# Altium schematic sheet EP1K100QC208-2.SchDoc
size A2
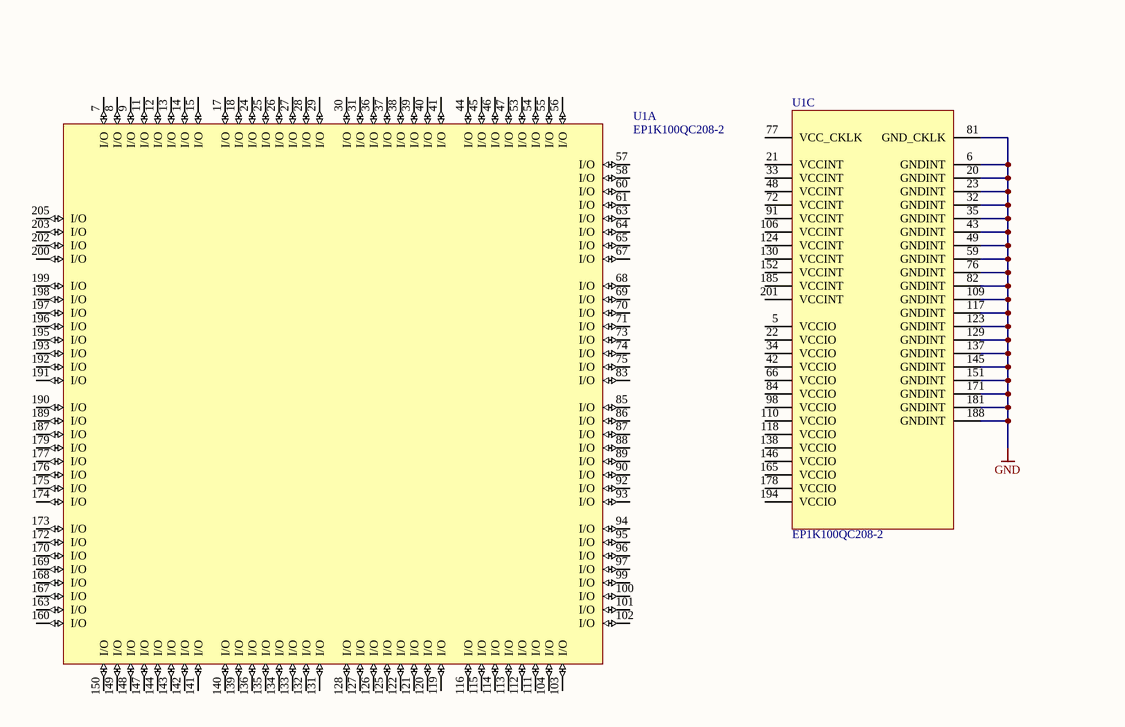
[diagram p0: EP1K100QC208-2.SchDoc, left]
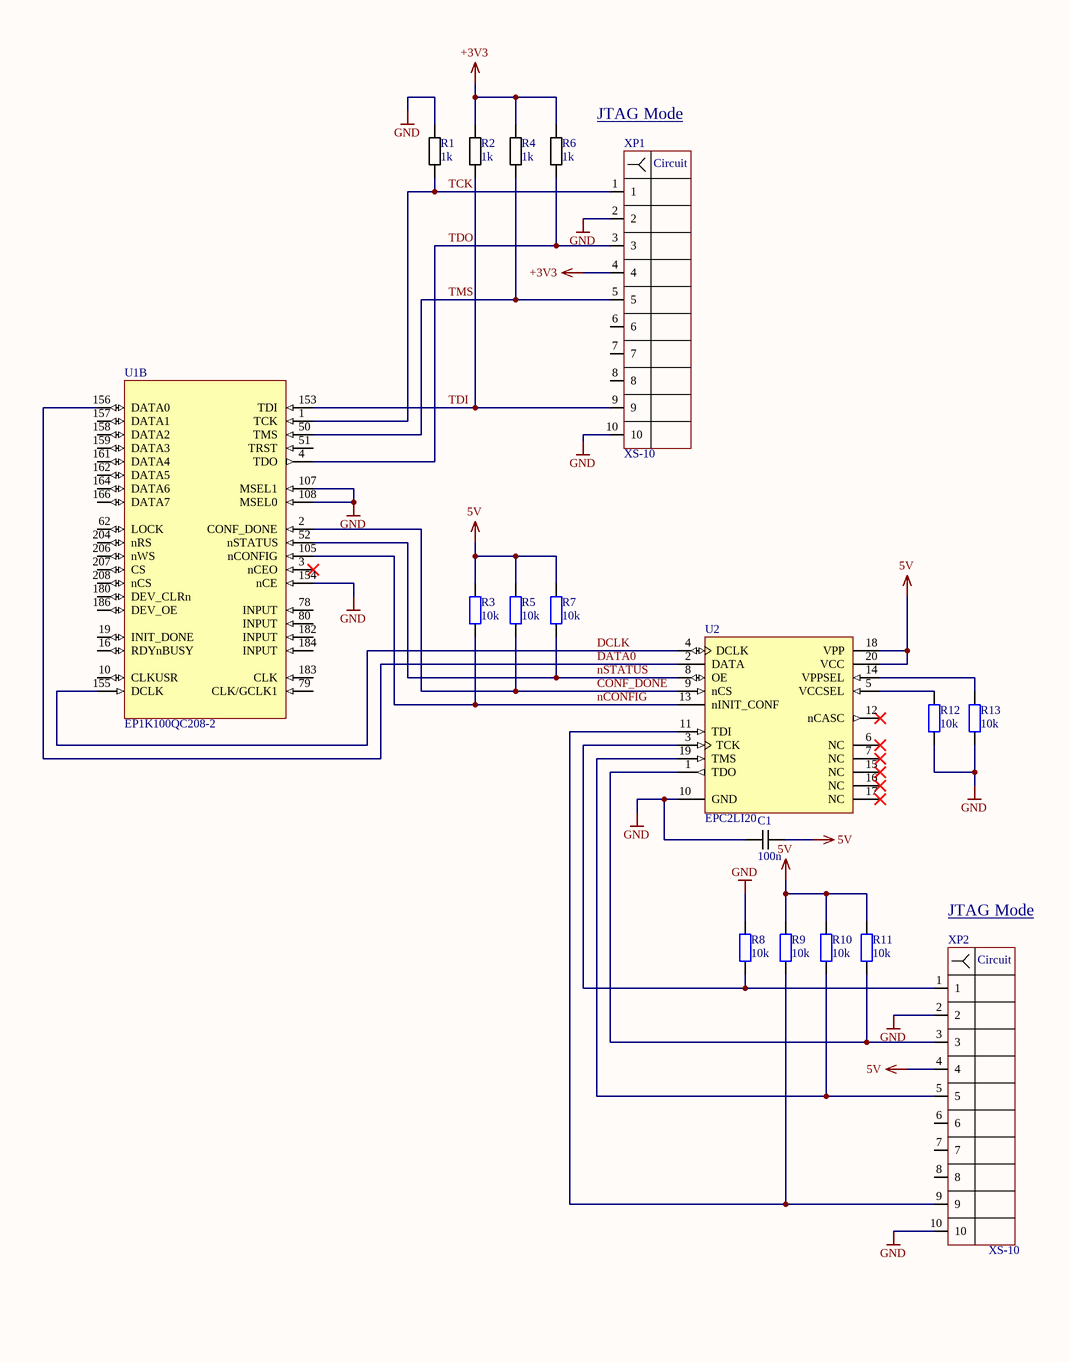
[diagram p1: EP1K100QC208-2.SchDoc, right]

## Parts
C1  100n  [CAPC1608(0603)N]
R1  1k  [RESC1608(0603)N]
R2  1k  [RESC1608(0603)N]
R3  10k  [RESC1608(0603)N]
R4  1k  [RESC1608(0603)N]
R5  10k  [RESC1608(0603)N]
R6  1k  [RESC1608(0603)N]
R7  10k  [RESC1608(0603)N]
R8  10k  [RESC1608(0603)N]
R9  10k  [RESC1608(0603)N]
R10  10k  [RESC1608(0603)N]
R11  10k  [RESC1608(0603)N]
R12  10k  [RESC1608(0603)N]
R13  10k  [RESC1608(0603)N]
U1  EP1K100QC208-2  [PQFP208_N]  (parts A,B,C of 3)
U2  EPC2LI20  [PLCC20_L]
XP1  XS-10  [BH-10]
XP2  XS-10  [BH-10]

## Nets
5V: C1.2 R3.1 R5.1 R7.1 R9.1 R10.1 R11.1 U2.18(VPP) U2.20(VCC) XP2.4
+3V3: R2.2 R4.2 R6.2 XP1.4
GND: C1.1 R1.2 R8.2 R12.2 R13.2 U1.6(GNDINT) U1.20(GNDINT) U1.23(GNDINT) U1.32(GNDINT) U1.35(GNDINT) U1.43(GNDINT) U1.49(GNDINT) U1.59(GNDINT) U1.76(GNDINT) U1.81(GND_CKLK) U1.82(GNDINT) U1.107(MSEL1) U1.108(MSEL0) U1.109(GNDINT) U1.117(GNDINT) U1.123(GNDINT) U1.129(GNDINT) U1.137(GNDINT) U1.145(GNDINT) U1.151(GNDINT) U1.154(nCE) U1.171(GNDINT) U1.181(GNDINT) U1.188(GNDINT) U2.10(GND) XP1.2 XP1.10 XP2.2 XP2.10
CONF_DONE: R5.2 U1.2(CONF_DONE) U2.9(nCS)
DATA0: U1.156(DATA0) U2.2(DATA)
DCLK: U1.155(DCLK) U2.4(DCLK)
nCONFIG: R3.2 U1.105(nCONFIG) U2.13(nINIT_CONF)
nSTATUS: R7.2 U1.52(nSTATUS) U2.8(OE)
TCK: R1.1 U1.1(TCK) XP1.1
TDI: R2.1 U1.153(TDI) XP1.9
TDO: R6.1 U1.4(TDO) XP1.3
TMS: R4.1 U1.50(TMS) XP1.5
NetR8_1: R8.1 U2.3(TCK) XP2.1
NetR9_2: R9.2 U2.11(TDI) XP2.9
NetR10_2: R10.2 U2.19(TMS) XP2.5
NetR11_2: R11.2 U2.1(TDO) XP2.3
NetR12_1: R12.1 U2.5(VCCSEL)
NetR13_1: R13.1 U2.14(VPPSEL)

Not connected (* = marked no-connect by the designer): U1 3(nCEO)* 5(VCCIO) 7(I/O) 8(I/O) 9(I/O) 10(CLKUSR) 11(I/O) 12(I/O) 13(I/O) 14(I/O) 15(I/O) 16(RDYnBUSY) 17(I/O) 18(I/O) 19(INIT_DONE) 21(VCCINT) 22(VCCIO) 24(I/O) 25(I/O) 26(I/O) 27(I/O) 28(I/O) 29(I/O) 30(I/O) 31(I/O) 33(VCCINT) 34(VCCIO) 36(I/O) 37(I/O) 38(I/O) 39(I/O) 40(I/O) 41(I/O) 42(VCCIO) 44(I/O) 45(I/O) 46(I/O) 47(I/O) 48(VCCINT) 51(TRST) 53(I/O) 54(I/O) 55(I/O) 56(I/O) 57(I/O) 58(I/O) 60(I/O) 61(I/O) 62(LOCK) 63(I/O) 64(I/O) 65(I/O) 66(VCCIO) 67(I/O) 68(I/O) 69(I/O) 70(I/O) 71(I/O) 72(VCCINT) 73(I/O) 74(I/O) 75(I/O) 77(VCC_CKLK) 78(INPUT) 79(CLK/GCLK1) 80(INPUT) 83(I/O) 84(VCCIO) 85(I/O) 86(I/O) 87(I/O) 88(I/O) 89(I/O) 90(I/O) 91(VCCINT) 92(I/O) 93(I/O) 94(I/O) 95(I/O) 96(I/O) 97(I/O) 98(VCCIO) 99(I/O) 100(I/O) 101(I/O) 102(I/O) 103(I/O) 104(I/O) 106(VCCINT) 110(VCCIO) 111(I/O) 112(I/O) 113(I/O) 114(I/O) 115(I/O) 116(I/O) 118(VCCIO) 119(I/O) 120(I/O) 121(I/O) 122(I/O) 124(VCCINT) 125(I/O) 126(I/O) 127(I/O) 128(I/O) 130(VCCINT) 131(I/O) 132(I/O) 133(I/O) 134(I/O) 135(I/O) 136(I/O) 138(VCCIO) 139(I/O) 140(I/O) 141(I/O) 142(I/O) 143(I/O) 144(I/O) 146(VCCIO) 147(I/O) 148(I/O) 149(I/O) 150(I/O) 152(VCCINT) 157(DATA1) 158(DATA2) 159(DATA3) 160(I/O) 161(DATA4) 162(DATA5) 163(I/O) 164(DATA6) 165(VCCIO) 166(DATA7) 167(I/O) 168(I/O) 169(I/O) 170(I/O) 172(I/O) 173(I/O) 174(I/O) 175(I/O) 176(I/O) 177(I/O) 178(VCCIO) 179(I/O) 180(DEV_CLRn) 182(INPUT) 183(CLK) 184(INPUT) 185(VCCINT) 186(DEV_OE) 187(I/O) 189(I/O) 190(I/O) 191(I/O) 192(I/O) 193(I/O) 194(VCCIO) 195(I/O) 196(I/O) 197(I/O) 198(I/O) 199(I/O) 200(I/O) 201(VCCINT) 202(I/O) 203(I/O) 204(nRS) 205(I/O) 206(nWS) 207(CS) 208(nCS); U2 6(NC)* 7(NC)* 12(nCASC)* 15(NC)* 16(NC)* 17(NC)*; XP1 6 7 8; XP2 6 7 8

## Notes on the sheet
- JTAG Mode
- (in symbol 3220-10-0100-00) Circuit
- (in symbol BH-10) Circuit

## Library data of the parts
C1 = CAPC1608(0603): ?; Part Number: CAPC1608(0603); HelpURL: ?; Digi-Key Part Number: ?; Price$: ?; Note: ?; Manufacturer Part Number: ?; Package: ?
R1 R2 R4 R6 = RESC1608(0603): Note: ???; Part Number: RESC1608(0603); HelpURL: ???; Digi-Key Part Number: ???; Price$: ???; Manufacturer Part Number: ???; Package: ???
R3 R5 R7-R13 = RESC1608(0603): Resistor; Manufacturer Part Number: ???; Part Number: RESC1608(0603); Digi-Key Part Number: ???; HelpURL: ???; Note: ???; Package: ???; Price$: ???
U2 = EPC2LI20: IC - Ser. Config Mem Flash 1.6Mb 10 MHz; Configures: Stratix II, Stratix, Stratix GX, Cyclone II, Cyclone, APEX II, APEX, FLEX, Mercury, ACEX, and Excalibur Devices; Published: 17-Sep-2003; LatestRevisionDate: 13-Apr-2006; LatestRevisionNote: IPC-7351 Footprint Added.; DatasheetVersion: ver2.0, Oct-2003; PackageVersion: ver14.2, Oct-2005; PackageReference: PLCC20; Publisher: Altium Limited; PackageDescription: 20-Pin Plastic J-Lead Chip Carrier (PLCC20); Supplier 1: Digi-Key; Supplier Part Number 1: 544-1234-5-ND; Code_JEDEC: MS-018-AA; Code_IPC: PLCC-20; ComponentLink1Description: Manufacturer Link; ComponentLink1URL: http://www.altera.com/products/devices/config/cfg-index.html; ComponentLink2Description: Configuration Handbook; ComponentLink2URL: http://www.altera.com/literature/hb/cfg/config_handbook.pdf; ComponentLink3Description: Pinout Specification; ComponentLink3URL: http://www.altera.com/literature/hb/cfg/cfg_cf52004.pdf; ComponentLink4Description: Packaging Specification; ComponentLink4URL: http://www.altera.com/literature/ds/dspkg.pdf; Part Number: EPC2LI20; HelpURL: http://www.mouser.com/ds/2/591/cfg_cf52004-472543.pdf
XP1 = 3220-10-0100-00: Part Number: 3220-10-0100-00; Digi-Key Part Number: 1175-1627-ND; HelpURL: https://www.digikey.com/product-detail/en/cnc-tech/3220-10-0100-00/1175-1627-ND/3883661
XP2 = BH-10: Part Number: BH-10
U1 = EP1K100QC208-2: Published: 17-Jul-2002; LatestRevisionDate: 13-Apr-2006; LatestRevisionNote: IPC-7351 Footprint Added.; DatasheetVersion: ver3.4, May-2003; PackageVersion: ver15.4, Dec-2008; PackageReference: PQFP208; Publisher: Altium Limited; PackageDescription: 208-Pin Plastic Quad Flat Pack (PQFP208) - Wire Bond; Supplier 1: Digi-Key; Supplier Part Number 1: 544-1001-ND; Code_JEDEC: MS-029-FA-1; ComponentLink1Description: Manufacturer Link; ComponentLink1URL: http://www.altera.com/products/devices/acex/acx-index.html; ComponentLink2Description: Datasheet; ComponentLink2URL: http://www.altera.com/literature/ds/acex.pdf; Part Number: EP1K100QC208-2